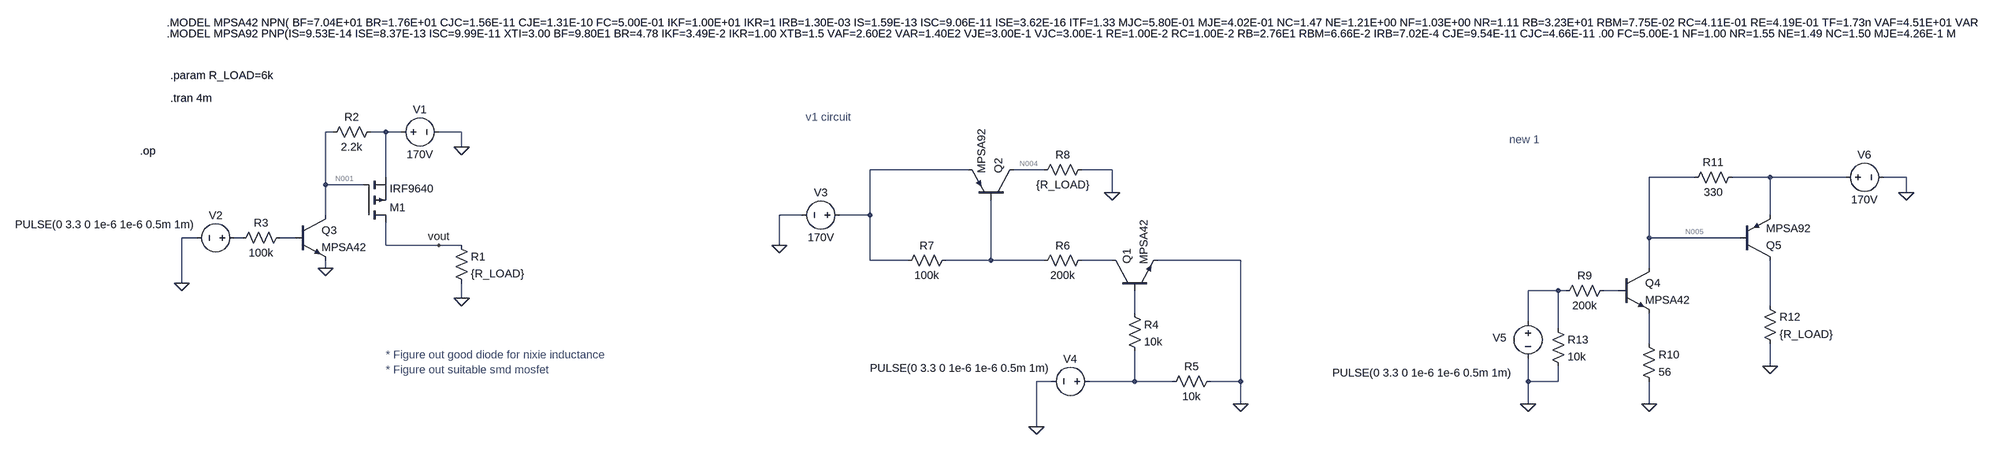
[diagram p0: schematic HV_switching.asc]
HV_switching.asc, the LTspice schematic file:
Version 4
SHEET 1 5300 848
WIRE 144 -32 128 -32
WIRE 256 -32 224 -32
WIRE 288 -32 256 -32
WIRE 416 -32 368 -32
WIRE 416 0 416 -32
WIRE 1488 48 1280 48
WIRE 1648 48 1584 48
WIRE 1792 48 1728 48
WIRE 256 64 256 -32
WIRE 3024 64 2928 64
WIRE 3184 64 3104 64
WIRE 3344 64 3184 64
WIRE 3472 64 3424 64
WIRE 128 80 128 -32
WIRE 208 80 128 80
WIRE 1792 96 1792 48
WIRE 3472 96 3472 64
WIRE 128 144 128 80
WIRE 1136 144 1088 144
WIRE 1280 144 1280 48
WIRE 1280 144 1216 144
WIRE 3184 144 3184 64
WIRE -144 192 -176 192
WIRE -48 192 -64 192
WIRE 64 192 32 192
WIRE 2928 192 2928 64
WIRE 3120 192 2928 192
WIRE 256 208 256 160
WIRE 368 208 256 208
WIRE 416 208 368 208
WIRE 1088 208 1088 144
WIRE 1280 240 1280 144
WIRE 1360 240 1280 240
WIRE 1536 240 1536 112
WIRE 1536 240 1440 240
WIRE 1648 240 1536 240
WIRE 1792 240 1728 240
WIRE 2064 240 1888 240
WIRE 128 256 128 240
WIRE 2928 256 2928 192
WIRE -176 288 -176 192
WIRE 2736 304 2672 304
WIRE 2752 304 2736 304
WIRE 2864 304 2832 304
WIRE 416 320 416 288
WIRE 3184 336 3184 240
WIRE 1840 352 1840 304
WIRE 2672 368 2672 304
WIRE 2736 384 2736 304
WIRE 2928 416 2928 352
WIRE 3184 464 3184 416
WIRE 1664 496 1632 496
WIRE 1840 496 1840 432
WIRE 1840 496 1744 496
WIRE 1920 496 1840 496
WIRE 2064 496 2064 240
WIRE 2064 496 2000 496
WIRE 2672 496 2672 448
WIRE 2736 496 2736 464
WIRE 2736 496 2672 496
WIRE 2064 544 2064 496
WIRE 2672 544 2672 496
WIRE 2928 544 2928 496
WIRE 1632 592 1632 496
FLAG 416 0 0
FLAG 416 320 0
FLAG 368 208 vout
FLAG 128 256 0
FLAG -176 288 0
FLAG 2064 544 0
FLAG 1088 208 0
FLAG 1792 96 0
FLAG 1632 592 0
FLAG 2672 544 0
FLAG 2928 544 0
FLAG 3184 464 0
FLAG 3472 96 0
SYMBOL voltage 272 -32 R270
WINDOW 0 32 56 VTop 2
WINDOW 3 -32 56 VBottom 2
SYMATTR InstName V1
SYMATTR Value 170V
SYMBOL res 400 192 R0
SYMATTR InstName R1
SYMATTR Value {R_LOAD}
SYMBOL voltage -48 192 R90
WINDOW 0 -32 56 VBottom 2
WINDOW 3 -44 290 VTop 2
WINDOW 123 0 0 Left 0
WINDOW 39 0 0 Left 0
SYMATTR InstName V2
SYMATTR Value PULSE(0 3.3 0 1e-6 1e-6 0.5m 1m)
SYMBOL npn 64 144 R0
SYMATTR InstName Q3
SYMATTR Value MPSA42
SYMBOL res 240 -48 R90
WINDOW 0 0 56 VBottom 2
WINDOW 3 32 56 VTop 2
SYMATTR InstName R2
SYMATTR Value 2.2k
SYMBOL pmos 208 160 M180
SYMATTR InstName M1
SYMATTR Value IRF9640
SYMBOL res 48 176 R90
WINDOW 0 0 56 VBottom 2
WINDOW 3 32 56 VTop 2
SYMATTR InstName R3
SYMATTR Value 100k
SYMBOL npn 1792 304 R270
SYMATTR InstName Q1
SYMATTR Value MPSA42
SYMBOL res 1824 336 R0
SYMATTR InstName R4
SYMATTR Value 10k
SYMBOL res 2016 480 R90
WINDOW 0 0 56 VBottom 2
WINDOW 3 32 56 VTop 2
SYMATTR InstName R5
SYMATTR Value 10k
SYMBOL res 1744 224 R90
WINDOW 0 0 56 VBottom 2
WINDOW 3 32 56 VTop 2
SYMATTR InstName R6
SYMATTR Value 200k
SYMBOL pnp 1584 112 M270
SYMATTR InstName Q2
SYMATTR Value MPSA92
SYMBOL res 1456 224 R90
WINDOW 0 0 56 VBottom 2
WINDOW 3 32 56 VTop 2
SYMATTR InstName R7
SYMATTR Value 100k
SYMBOL voltage 1232 144 R90
WINDOW 0 -32 56 VBottom 2
WINDOW 3 32 56 VTop 2
SYMATTR InstName V3
SYMATTR Value 170V
SYMBOL res 1632 64 R270
WINDOW 0 32 56 VTop 2
WINDOW 3 0 56 VBottom 2
SYMATTR InstName R8
SYMATTR Value {R_LOAD}
SYMBOL voltage 1760 496 R90
WINDOW 0 -32 56 VBottom 2
WINDOW 3 -44 290 VTop 2
WINDOW 123 0 0 Left 0
WINDOW 39 0 0 Left 0
SYMATTR InstName V4
SYMATTR Value PULSE(0 3.3 0 1e-6 1e-6 0.5m 1m)
SYMBOL voltage 2672 352 R0
WINDOW 0 -60 67 Bottom 2
WINDOW 3 -223 110 Top 2
WINDOW 123 0 0 Left 0
WINDOW 39 0 0 Left 0
SYMATTR InstName V5
SYMATTR Value PULSE(0 3.3 0 1e-6 1e-6 0.5m 1m)
SYMBOL npn 2864 256 R0
SYMATTR InstName Q4
SYMATTR Value MPSA42
SYMBOL res 2848 288 R90
WINDOW 0 0 56 VBottom 2
WINDOW 3 32 56 VTop 2
SYMATTR InstName R9
SYMATTR Value 200k
SYMBOL res 2912 400 R0
SYMATTR InstName R10
SYMATTR Value 56
SYMBOL res 3120 48 R90
WINDOW 0 0 56 VBottom 2
WINDOW 3 32 56 VTop 2
SYMATTR InstName R11
SYMATTR Value 330
SYMBOL pnp 3120 240 M180
SYMATTR InstName Q5
SYMATTR Value MPSA92
SYMBOL res 3168 320 R0
SYMATTR InstName R12
SYMATTR Value {R_LOAD}
SYMBOL voltage 3328 64 R270
WINDOW 0 32 56 VTop 2
WINDOW 3 -32 56 VBottom 2
SYMATTR InstName V6
SYMATTR Value 170V
SYMBOL res 2720 368 R0
SYMATTR InstName R13
SYMATTR Value 10k
TEXT -264 8 Left 2 !.op
TEXT -208 -264 Left 2 !.MODEL MPSA42 NPN( BF=7.04E+01 BR=1.76E+01 CJC=1.56E-11 CJE=1.31E-10 FC=5.00E-01 IKF=1.00E+01 IKR=1 IRB=1.30E-03 IS=1.59E-13 ISC=9.06E-11 ISE=3.62E-16 ITF=1.33 MJC=5.80E-01 MJE=4.02E-01 NC=1.47 NE=1.21E+00 NF=1.03E+00 NR=1.11 RB=3.23E+01 RBM=7.75E-02 RC=4.11E-01 RE=4.19E-01 TF=1.73n VAF=4.51E+01 VAR=9.11E+01 VJC=4.64E-01 VJE=3.00E-01 VTF=9.99E+05 XTB=0 XTF=1.00E+02 XTI=3)
TEXT -208 -240 Left 2 !.MODEL MPSA92 PNP(IS=9.53E-14 ISE=8.37E-13 ISC=9.99E-11 XTI=3.00 BF=9.80E1 BR=4.78 IKF=3.49E-2 IKR=1.00 XTB=1.5 VAF=2.60E2 VAR=1.40E2 VJE=3.00E-1 VJC=3.00E-1 RE=1.00E-2 RC=1.00E-2 RB=2.76E1 RBM=6.66E-2 IRB=7.02E-4 CJE=9.54E-11 CJC=4.66E-11 .00 FC=5.00E-1 NF=1.00 NR=1.55 NE=1.49 NC=1.50 MJE=4.26E-1 MJC=7.00E-1 TF=9.52E-10 TR=516.9p ITF=4.12E-1 VTF=9.99E5 XTF=1.03 EG=1.11 VCEO=300 ICRATING=500m MFG=SIEMENS)
TEXT -200 -104 Left 2 !.tran 4m
TEXT 256 440 Left 2 ;* Figure out good diode for nixie inductance\n* Figure out suitable smd mosfet
TEXT -200 -152 Left 2 !.param R_LOAD=6k
TEXT 1144 -64 Left 2 ;v1 circuit
TEXT 2632 -16 Left 2 ;new 1

The netlist it stands for:
* HV_switching.asc
V1 N002 0 170V
R1 vout 0 {R_LOAD}
V2 N007 0 PULSE(0 3.3 0 1e-6 1e-6 0.5m 1m)
Q3 N001 N008 0 0 MPSA42
R2 N002 N001 2.2k
M1 vout N001 N002 N002 IRF9640
R3 N008 N007 100k
Q1 N010 N014 0 0 MPSA42
R4 N014 N016 10k
R5 0 N016 10k
R6 N010 N009 200k
Q2 N004 N009 N003 0 MPSA92
R7 N009 N003 100k
V3 N003 0 170V
R8 N004 0 {R_LOAD}
V4 N016 0 PULSE(0 3.3 0 1e-6 1e-6 0.5m 1m)
V5 N011 0 PULSE(0 3.3 0 1e-6 1e-6 0.5m 1m)
Q4 N005 N012 N015 0 MPSA42
R9 N012 N011 200k
R10 N015 0 56
R11 N006 N005 330
Q5 N013 N005 N006 0 MPSA92
R12 N013 0 {R_LOAD}
V6 N006 0 170V
R13 N011 0 10k
.model NPN NPN
.model PNP PNP
.lib standard.bjt
.model NMOS NMOS
.model PMOS PMOS
.lib standard.mos
.op
.MODEL MPSA42 NPN( BF=7.04E+01 BR=1.76E+01 CJC=1.56E-11 CJE=1.31E-10 FC=5.00E-01 IKF=1.00E+01 IKR=1 IRB=1.30E-03 IS=1.59E-13 ISC=9.06E-11 ISE=3.62E-16 ITF=1.33 MJC=5.80E-01 MJE=4.02E-01 NC=1.47 NE=1.21E+00 NF=1.03E+00 NR=1.11 RB=3.23E+01 RBM=7.75E-02 RC=4.11E-01 RE=4.19E-01 TF=1.73n VAF=4.51E+01 VAR=9.11E+01 VJC=4.64E-01 VJE=3.00E-01 VTF=9.99E+05 XTB=0 XTF=1.00E+02 XTI=3)
.MODEL MPSA92 PNP(IS=9.53E-14 ISE=8.37E-13 ISC=9.99E-11 XTI=3.00 BF=9.80E1 BR=4.78 IKF=3.49E-2 IKR=1.00 XTB=1.5 VAF=2.60E2 VAR=1.40E2 VJE=3.00E-1 VJC=3.00E-1 RE=1.00E-2 RC=1.00E-2 RB=2.76E1 RBM=6.66E-2 IRB=7.02E-4 CJE=9.54E-11 CJC=4.66E-11 .00 FC=5.00E-1 NF=1.00 NR=1.55 NE=1.49 NC=1.50 MJE=4.26E-1 MJC=7.00E-1 TF=9.52E-10 TR=516.9p ITF=4.12E-1 VTF=9.99E5 XTF=1.03 EG=1.11 VCEO=300 ICRATING=500m MFG=SIEMENS)
.tran 4m
* * Figure out good diode for nixie inductance
* * Figure out suitable smd mosfet
.param R_LOAD=6k
* v1 circuit
* new 1
.backanno
.end

* Results of the author's LTspice run, read from the files saved beside the schematic
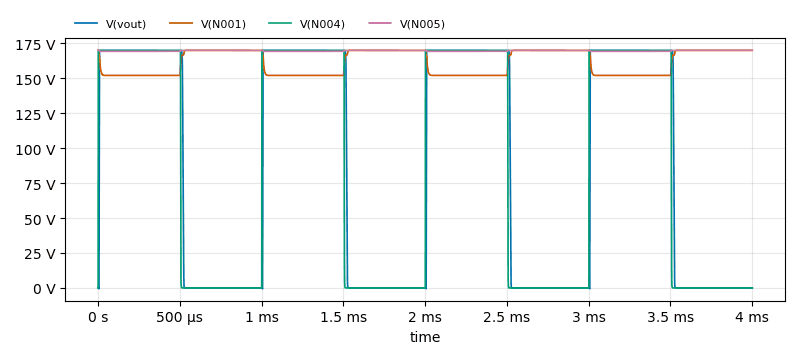
[diagram p1: Transient Analysis of HV_switching.asc, plotted from the saved traces]
* Transient Analysis, 1 run:
*   V(vout): min -630.1 mV, max 170 V, average 87.13 V, rms 121.5 V, last 0 V
*   V(N001): min 152 V, max 170 V, average 161.1 V, rms 161.3 V, last 170 V
*   V(N004): min -5.664 mV, max 169.9 V, average 85.69 V, rms 120.6 V, last 0 V
*   V(N005): min 169.3 V, max 170 V, average 169.6 V, rms 169.6 V, last 170 V